# EAGLE design rev17 (EAGLE 7.5.0)
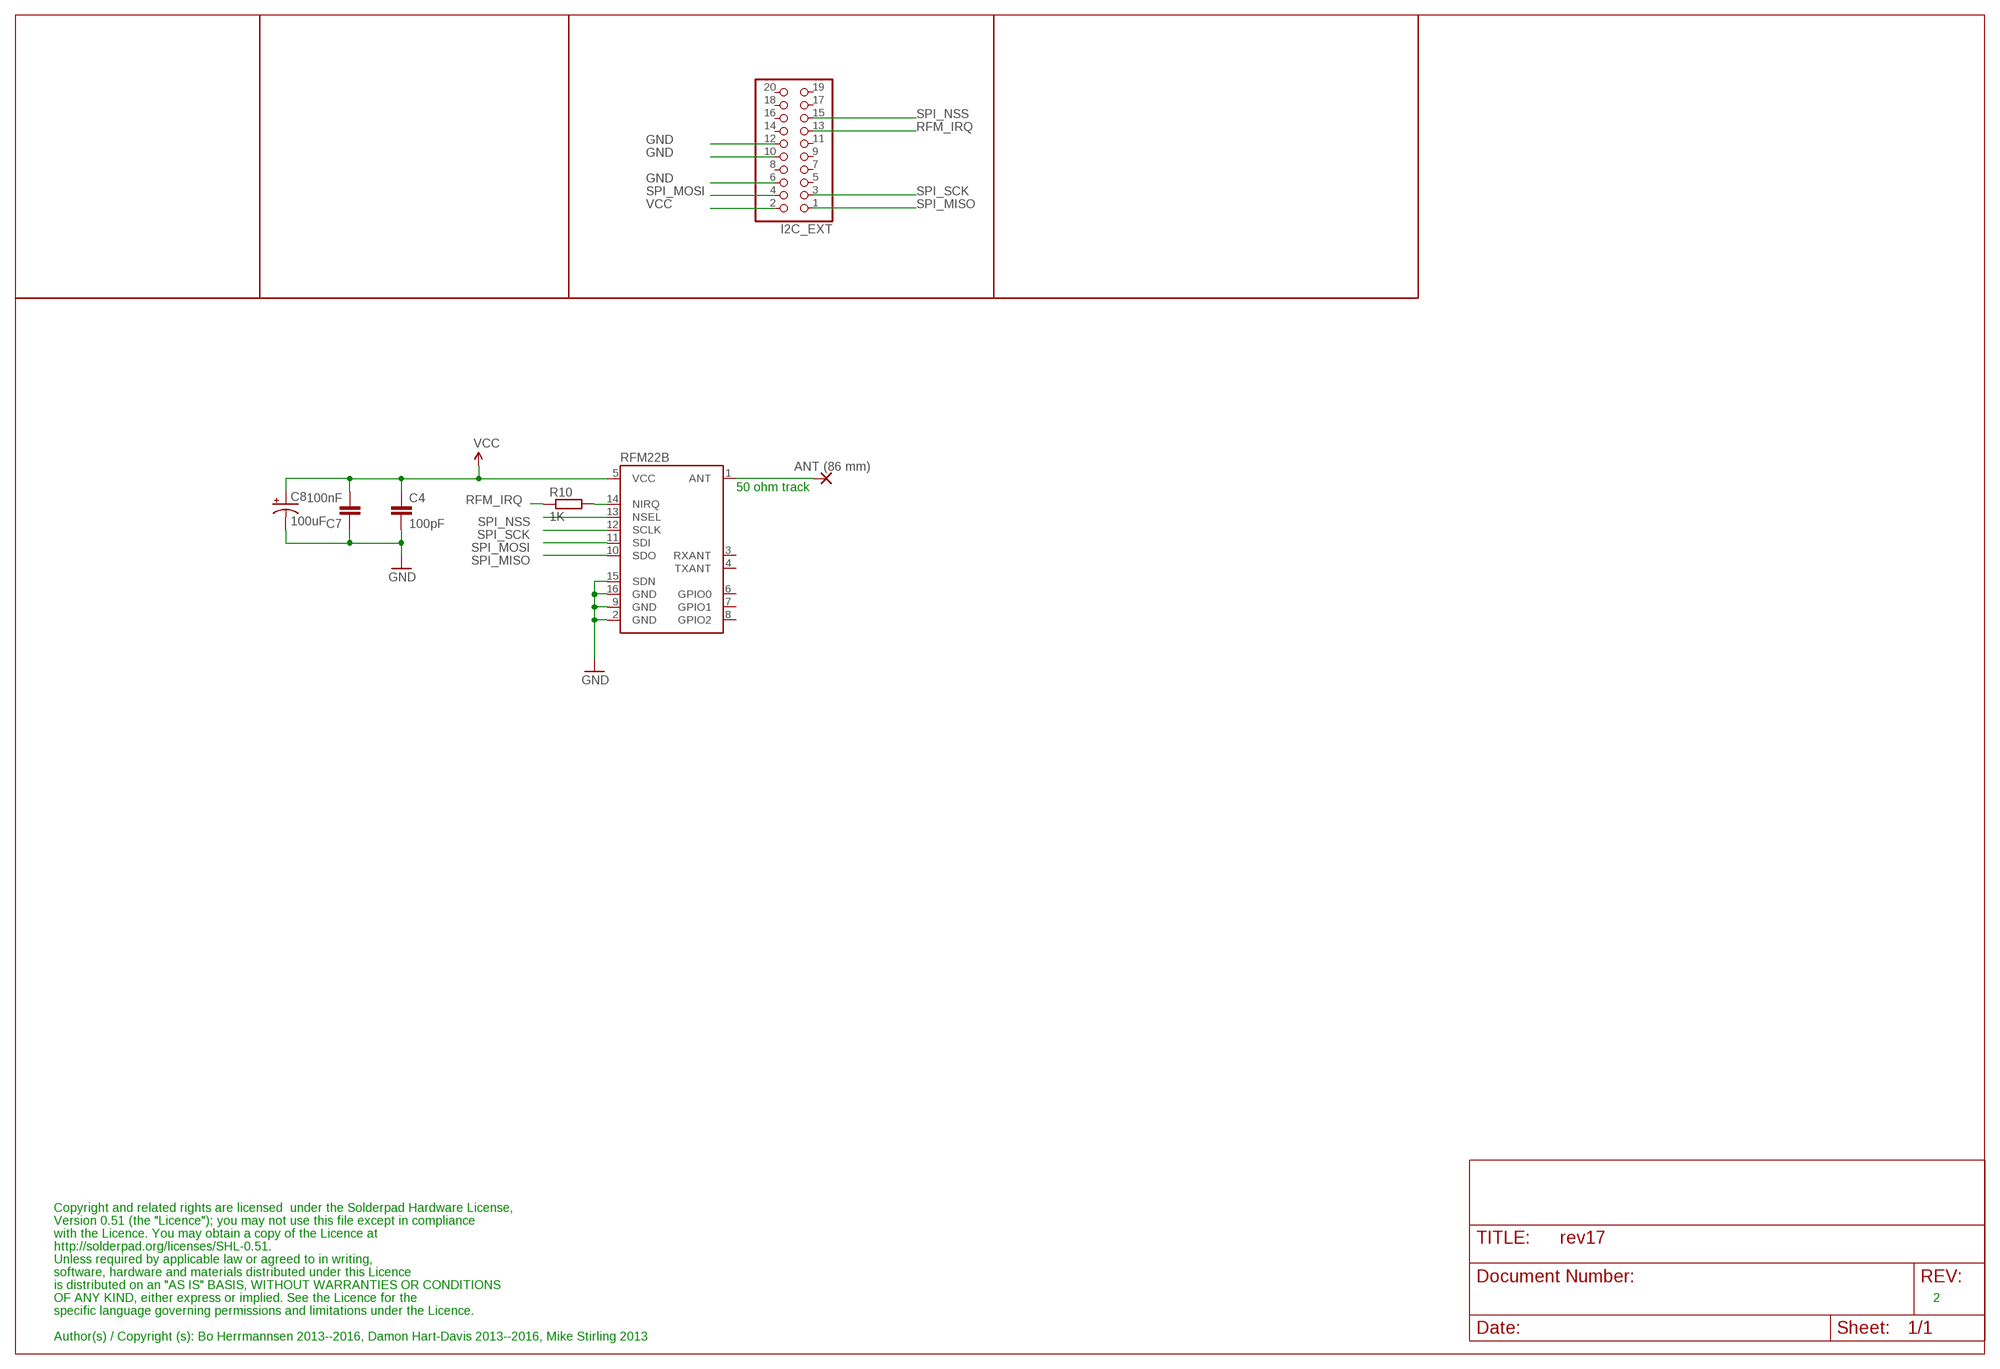
[diagram p0: schematic, sheet 1]

## Parts
ANT  ANT (86 mm)  2,15/1,0  [2,15/1,0]
C4  100pF  CAP0603-CAP  [0603-CAP]
C7  100nF  CAP0603-CAP  [0603-CAP]
C8  100uF  CAP_POL1206  [EIA3216]
I2C_EXT  PINHD-2X10  [2X10]
R10  1K  R-EU_R0603  [R0603]
RFM22B  RFM22SMD  [RFM22-XXX-S2]

## Nets
GND [supply]: C4.2 C7.1 C8.C(-) I2C_EXT.6 I2C_EXT.10 I2C_EXT.12 RFM22B.2(GND) RFM22B.9(GND) RFM22B.15(SDN) RFM22B.16(GND)
N$7: R10.2 RFM22B.14(NIRQ)
N$26 [ant]: ANT.1(P) RFM22B.1(ANT)
RFM_IRQ: I2C_EXT.13 R10.1
SPI_MISO: I2C_EXT.1 RFM22B.10(SDO)
SPI_MOSI: I2C_EXT.4 RFM22B.11(SDI)
SPI_NSS: I2C_EXT.15 RFM22B.13(NSEL)
SPI_SCK: I2C_EXT.3 RFM22B.12(SCLK)
VCC [supply]: C4.1 C7.2 C8.A(+) I2C_EXT.2 RFM22B.5(VCC)
Unconnected: I2C_EXT.5 I2C_EXT.7 I2C_EXT.8 I2C_EXT.9 I2C_EXT.11 I2C_EXT.14 I2C_EXT.16 I2C_EXT.17 I2C_EXT.18 I2C_EXT.19 I2C_EXT.20 RFM22B.3(RXANT) RFM22B.4(TXANT) RFM22B.6(GPIO0) RFM22B.7(GPIO1) RFM22B.8(GPIO2)

## Notes on the sheet
- 50 ohm track
- Copyright and related rights are licensed  under the Solderpad Hardware License,
- Version 0.51 (the "Licence"); you may not use this file except in compliance
- with the Licence. You may obtain a copy of the Licence at
- http://solderpad.org/licenses/SHL-0.51.
- Unless required by applicable law or agreed to in writing,
- software, hardware and materials distributed under this Licence
- is distributed on an "AS IS" BASIS, WITHOUT WARRANTIES OR CONDITIONS
- OF ANY KIND, either express or implied. See the Licence for the | 2
- specific language governing permissions and limitations under the Licence.
- Author(s) / Copyright (s): Bo Herrmannsen 2013--2016, Damon Hart-Davis 2013--2016, Mike Stirling 2013

## Library data of the parts
ANT = wirepad:2,15/1,0: THROUGH-HOLE PAD
C4 C7 = SparkFun-Passives:CAP: Capacitor Standard 0603 ceramic capacitor, and 0.1" leaded capacitor.
C8 = SparkFun-Passives:CAP_POL: Capacitor Polarized These are standard SMD and PTH capacitors. Normally 10uF, 47uF, and 100uF in electrolytic and tantalum varieties. Always verify the external diameter of the through hole cap, it varies with capacity, voltage, and manufacturer. The EIA devices should be standard.
I2C_EXT = pinhead:PINHD-2X10: PIN HEADER
R10 = resistor:R-EU_: RESISTOR, European symbol
RFM22B = SparkFun-RF:RFM22: The RFM22 is a low-power, low cost radio that is capable of operating in the 434MHz and 900MHz open bands. It's frequency is software defined and there are some very good libraries written for it.

## Net classes
0 default: width 0.203 mm
1 supply: width 0.406 mm, clearance 0.203 mm
2 ant: width 2.184 mm

## Board
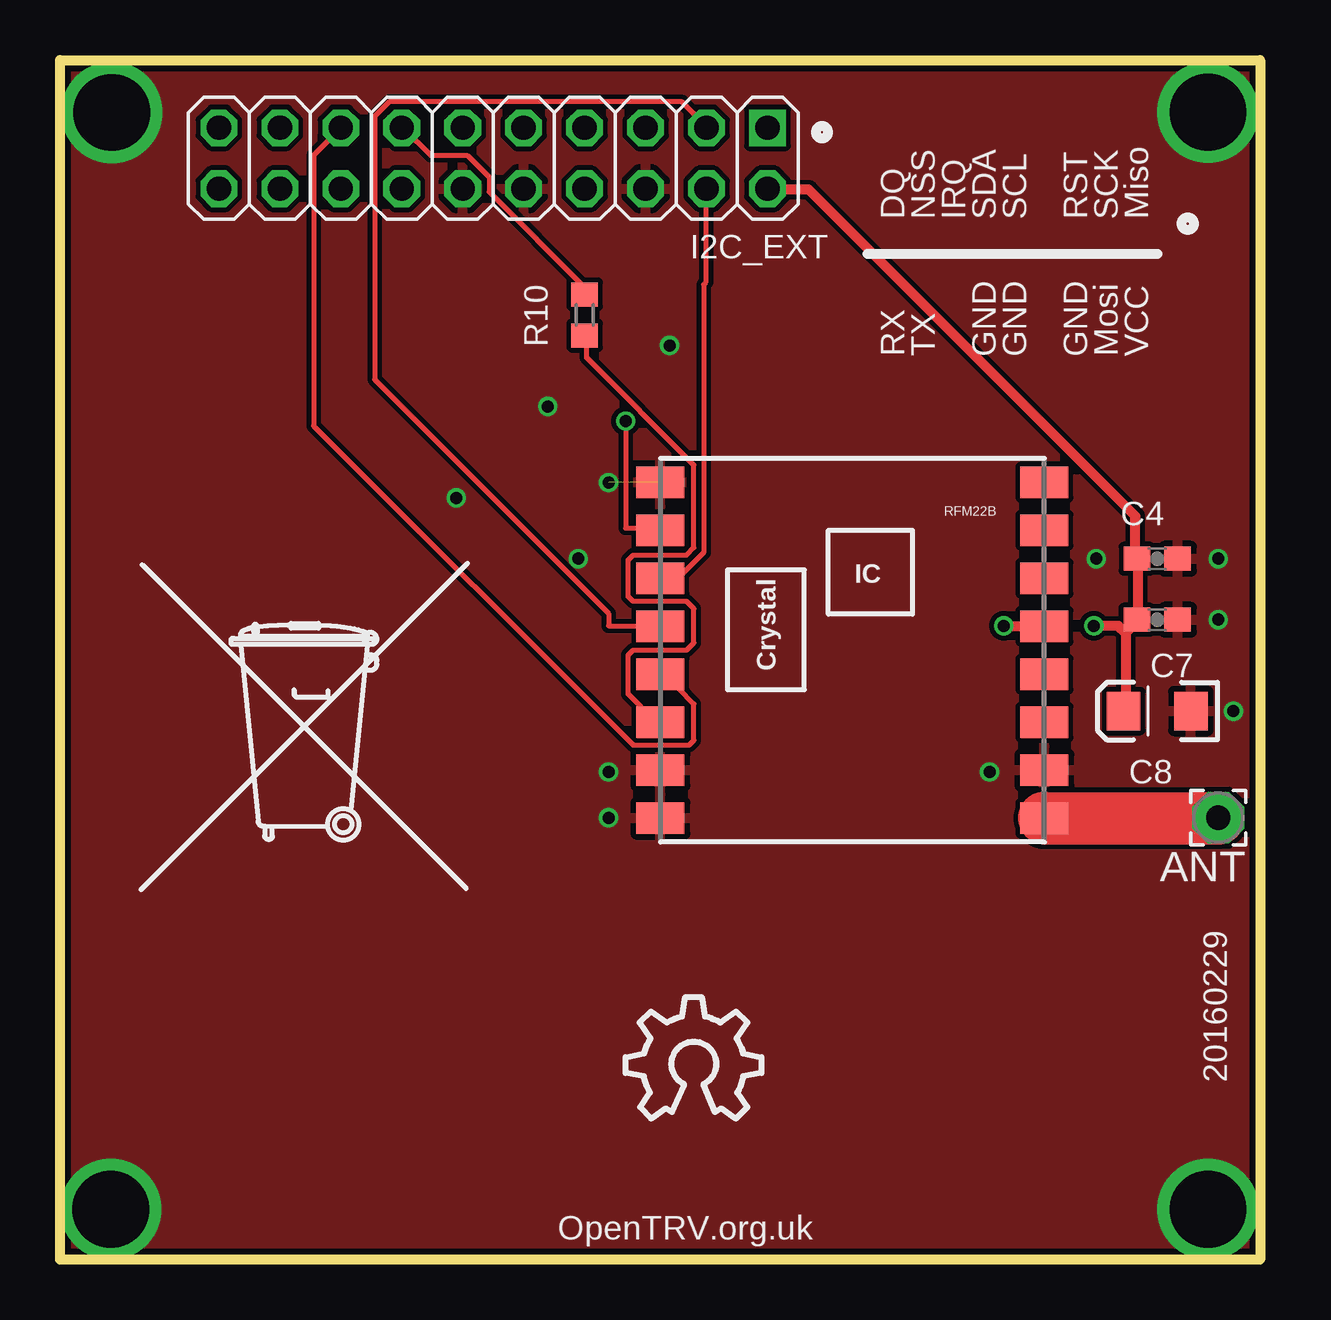
[diagram p1: board, top side]
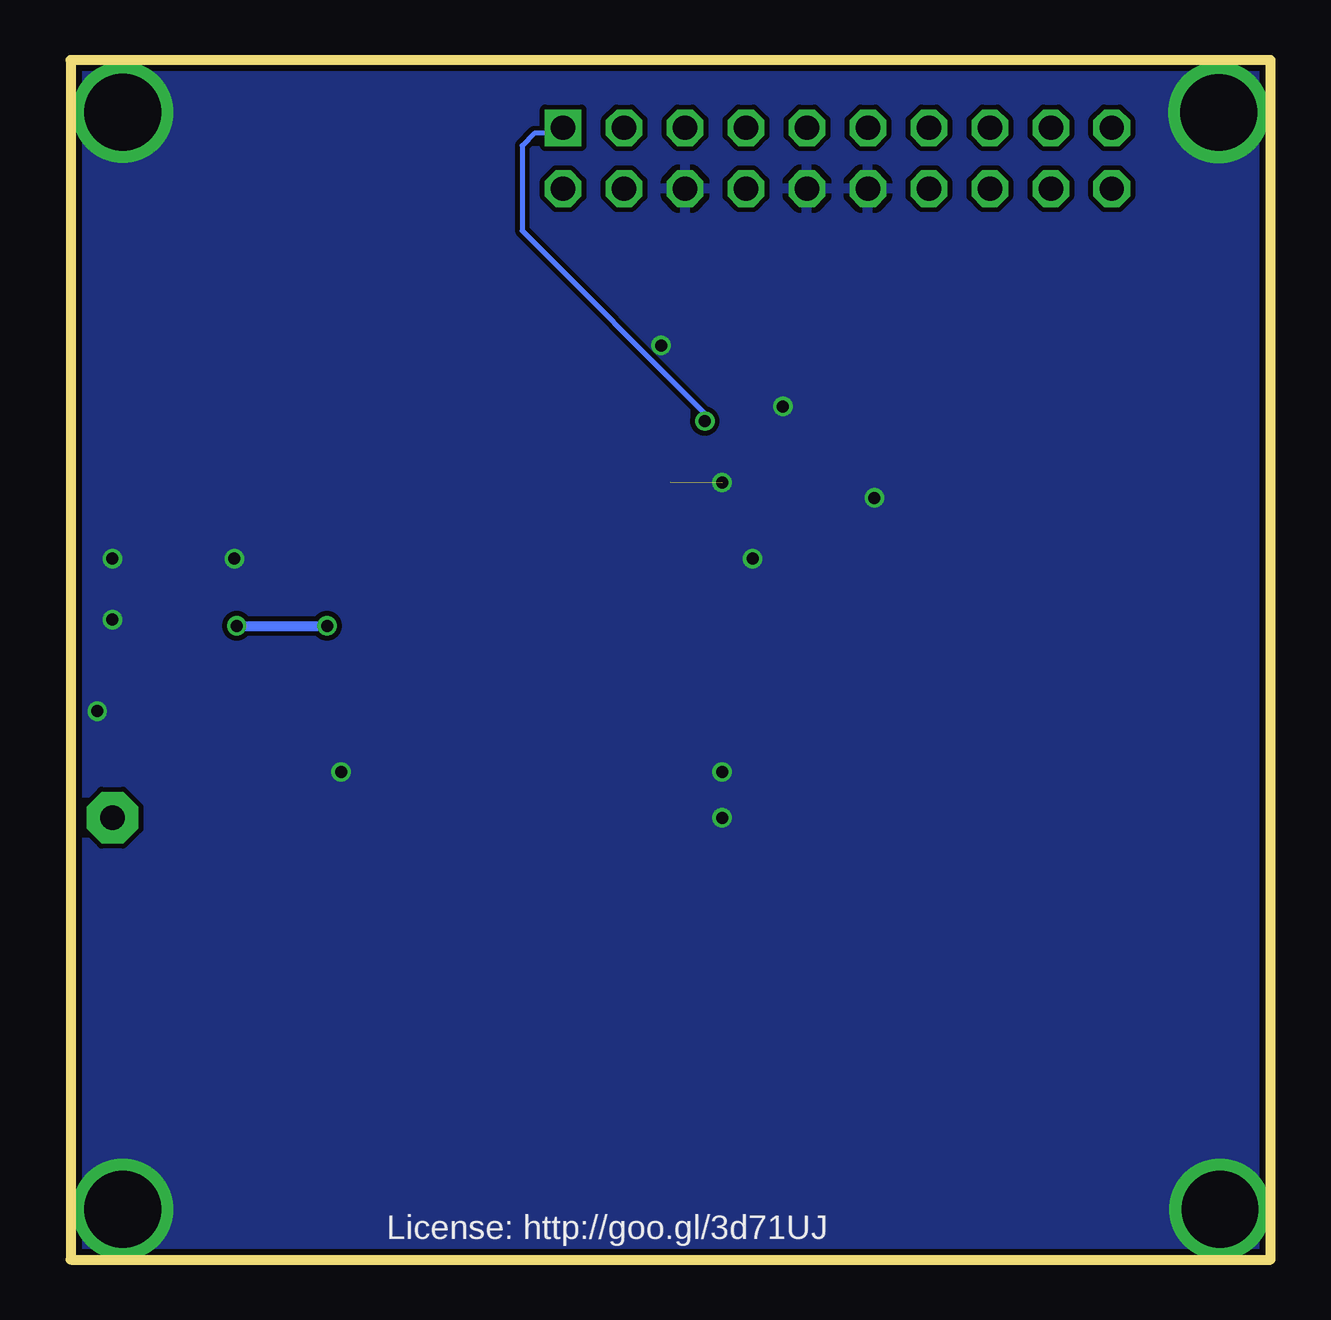
[diagram p2: board, bottom side, seen from below]

Size 50 x 50 mm. Coordinates in mm from the lower left corner, seen from the top.
Outline: 0,0 0,50 50,50 50,0 0,0
Copper layers (1*16): Top 0.035mm / dielectric 1.5mm / Bottom 0.035mm
Design rules "PMServicesStd *": minimum track width 8mil, minimum drill 0.5mm, track to track 8mil, track to pad 8mil, pad to pad 8mil, via to via 8mil, smd to smd 0mil, copper to edge 10mil, drill to drill 10mil, minimum pad ring 10mil, minimum via ring 6mil, stop-mask expansion 2mil, vias tented up to drill 100mil, thermal gap 10mil

### Footprints (pad centres in the part's own frame; a part is rotated, then mirrored left to right if it is on the bottom)
2,15/1,0 = drill 1.016 pad 2.159 octagon: 1 0,0
0603-CAP = smd 1.1 x 1: 1 -0.85,0; 2 0.85,0
EIA3216 = smd 1.4 x 1.6: A 1.4,0; C -1.4,0
2X10 = drill 1.016 square: 1 -11.43,-1.27 | drill 1.016 octagon: 2 -11.43,1.27; 3 -8.89,-1.27; 4 -8.89,1.27; 5 -6.35,-1.27; 6 -6.35,1.27; 7 -3.81,-1.27; 8 -3.81,1.27; 9 -1.27,-1.27; 10 -1.27,1.27; 11 1.27,-1.27; 12 1.27,1.27; 13 3.81,-1.27; 14 3.81,1.27; 15 6.35,-1.27; 16 6.35,1.27; 17 8.89,-1.27; 18 8.89,1.27; 19 11.43,-1.27; 20 11.43,1.27
R0603 = smd 1 x 1.1: 1 -0.85,0; 2 0.85,0
RFM22-XXX-S2 = smd 2 x 1.3: 1 -8,7; 2 -8,5; 3 -8,3; 4 -8,1; 5 -8,-1; 6 -8,-3; 7 -8,-5; 8 -8,-7; 9 8,-7; 10 8,-5; 11 8,-3; 12 8,-1; 13 8,1; 14 8,3; 15 8,5; 16 8,7

### Placement (x,y rotation side)
ANT  48.26,18.41 180 top
C4  45.72,29.21 0 top
C7  45.72,26.67 180 top
C8  45.72,22.86 180 top
I2C_EXT  18.05,45.91 180 top
R10  21.86,39.37 270 top
RFM22B  33.02,25.4 180 top
U$1  [OSHW_10X200_NOTEXT]  23.56,5.87 0 top
U$2  [TONNE]  10.03,19.47 0 top

### Tracks (layer width: path | path; a pad name or v marks a point on that pad's centre or on a via)
GND  (via drill 0.5, 3.2)  (1 unrouted)
  Top 0.406: 24.99,18.59 RFM22B.16
  other vias: 2.16,47.81 47.83,47.82 47.83,2.1 2.11,2.1 25.4,38.1 21.59,29.21 20.32,35.56 43.18,29.21 48.26,29.21 48.26,26.67 48.9,22.86 22.86,32.38 22.86,20.32 22.86,18.41 38.73,20.32 16.51,31.75
  pour Bottom: 0,50 0,0 50,0 50,50
  pour Top: 0,50 0,0 50,0 50,50
N$7
  Top 0.203: R10.2 21.95,38.51 21.95,37.59 26.42,33.12 26.42,29.67 26.11,29.36 23.88,29.36 23.67,29.16 23.67,27.64 23.88,27.43 26.11,27.43 26.42,27.13 26.42,25.7 26.11,25.4 23.88,25.4 23.67,25.2 23.67,23.57 24.79,22.45 24.99,22.45 RFM22B.14
N$26
  Top 2.184: RFM22B.1 41.05,18.39 48.26,18.39 ANT.1
RFM_IRQ
  Top 0.203: 21.84,40.23 R10.1 21.84,40.34 21.84,40.54 17.88,44.5 17.88,45.11 16.97,46.02 15.44,46.02 14.33,47.14 I2C_EXT.13
SPI_MISO  (via drill 0.5)
  Top 0.203: RFM22B.10 24.99,30.48 23.57,30.48 v23.57,34.95
  Bottom 0.203: v23.57,34.95 23.57,35.26 31.19,42.88 31.19,46.43 30.68,46.94 29.77,46.94 29.57,47.14 I2C_EXT.1
SPI_MOSI
  Top 0.203: RFM22B.11 25.09,28.45 25.81,28.45 26.82,29.46 26.82,40.64 26.92,40.74 26.92,44.6 I2C_EXT.4
SPI_NSS
  Top 0.203: 25.81,24.49 25.09,24.49 RFM22B.13 25.81,24.49 | I2C_EXT.15 11.68,47.14 10.57,46.02 10.57,34.75 23.88,21.44 26.21,21.44 26.42,21.64 26.42,23.16 25.81,23.77 25.81,24.49
SPI_SCK
  Top 0.203: RFM22B.12 24.99,26.42 22.86,26.42 22.86,26.92 13.11,36.68 13.11,47.65 13.72,48.26 25.91,48.26 26.92,47.24 I2C_EXT.3
VCC  (via drill 0.5)
  Top 0.406: 44.4,26.11 44.4,22.86 C8.A | 44.4,26.11 44.81,26.52 C7.2 44.91,26.72 44.91,29.16 C4.1 44.81,29.36 44.81,30.99 31.19,44.6 29.57,44.6 I2C_EXT.2 | v39.32,26.42 40.95,26.42 RFM22B.5 | v43.08,26.42 44.09,26.42 44.4,26.11
  Bottom 0.406: v43.08,26.42 v39.32,26.42

### Text on the board
bPlace: License: http://goo.gl/3d71UJ
tNames: DQ | NSS | IRQ | SDA | SCL | RST | SCK | Miso | RX | TX | GND | GND | GND | Mosi | VCC | 20160229 | OpenTRV.org.uk